# EAGLE design SD (EAGLE 7.2.0)
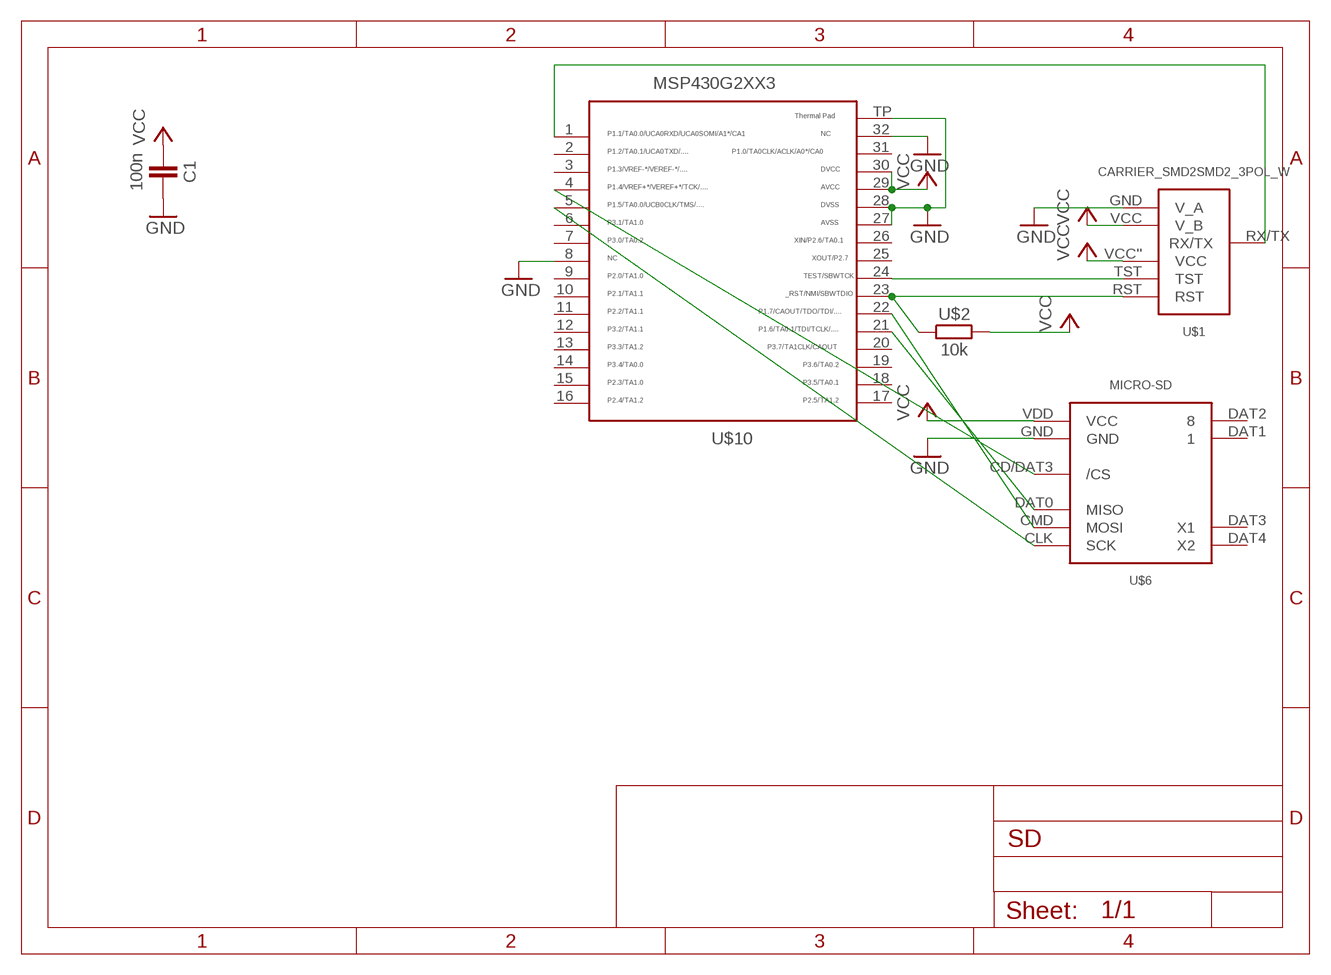
[diagram p0: schematic, sheet 1]

## Parts
C1  100n  CAPACITOR  [603]
U$1  CARRIER_SMD2SMD2_3POL_W  [CARRIER_SMD2_WIDE_3POL]
U$2  10k  RESISTOR0603  [603]
U$6  MICRO-SD  [SD-CARD-AMP]
U$10  MSP430G2553  [QFN32]

## Nets
GND: C1.2 U$1.GND(V_A) U$6.GND U$10.8 U$10.27 U$10.28 U$10.32 U$10.TP
N$3: U$1.TST U$10.24
N$4: U$1.RST U$2.1 U$10.23
N$6: U$6.CLK(SCK) U$10.5
N$7: U$6.CMD(MOSI) U$10.22
N$12: U$1.RX/TX U$10.1
N$14: U$6.DAT0(MISO) U$10.21
N$16: U$6.CD/DAT3(/CS) U$10.4
VCC: C1.1 U$1.VCC''(VCC) U$1.VCC(V_B) U$2.2 U$6.VDD(VCC) U$10.29 U$10.30
Unconnected: U$6.DAT1 U$6.DAT2 U$6.DAT3(X1) U$6.DAT4(X2) U$10.2 U$10.3 U$10.6 U$10.7 U$10.9 U$10.10 U$10.11 U$10.12 U$10.13 U$10.14 U$10.15 U$10.16 U$10.17 U$10.18 U$10.19 U$10.20 U$10.25 U$10.26 U$10.31

## Library data of the parts
C1 = thar:CAPACITOR
U$1 = thar:CARRIER_SMD2
U$2 = thar:RESISTOR
U$6 = thar:MICRO-SD: Micro SD Sockel/Footprint
U$10 = thar:MSP430G2553: TEXAS INSTRUMENTS MSP430G2553IRHB32R MCU, 16BIT, MSP430, 16MHZ, QFN-32 Farnell Best.Nr.: 2325726 Herst.Bez.: MSP430G2553IRHB32R

## Board
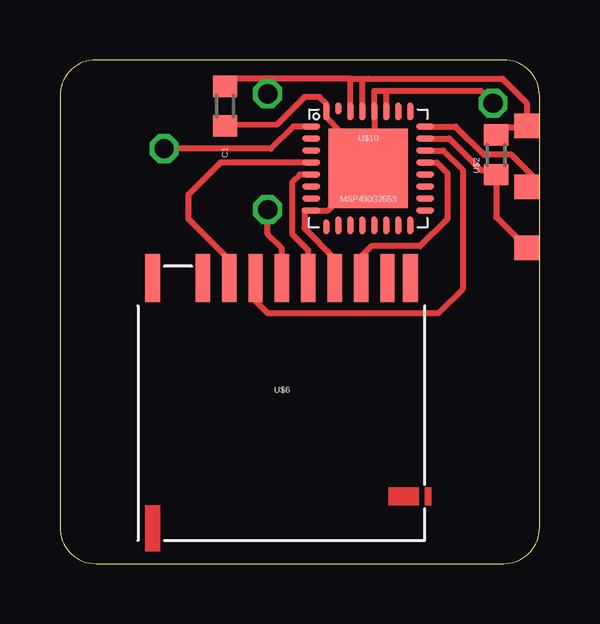
[diagram p1: board, top side]
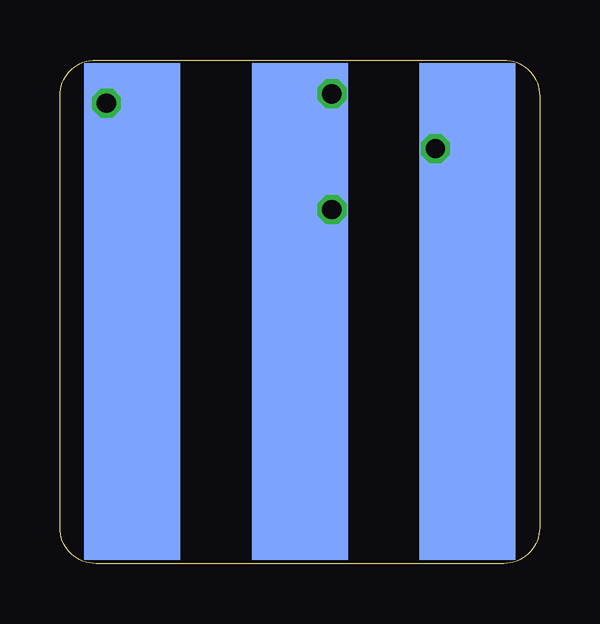
[diagram p2: board, bottom side, seen from below]

Size 20 x 21 mm. Coordinates in mm from the lower left corner, seen from the top.
Copper layers (1*16): Top 0.035mm / dielectric 1.5mm / Bottom 0.035mm
Design rules "Bilex DRU *": minimum track width 10mil, minimum drill 24mil, track to track 10mil, track to pad 10mil, pad to pad 10mil, via to via 10mil, smd to smd 10mil, copper to edge 1mil, drill to drill 8mil, minimum pad ring 10mil, minimum via ring 8mil, stop-mask expansion 4mil, vias tented up to drill 0mil, thermal gap 10mil

### Footprints (pad centres in the part's own frame; a part is rotated, then mirrored left to right if it is on the bottom)
603 = smd 0.889 x 1.016: 1 -0.826,0; 2 0.826,0
CARRIER_SMD2_WIDE_3POL = smd 4 x 20.7 bottom: GND -6.985,3.493; RX/TX 6.985,3.493; VCC 0,3.493 | smd 1.016 x 1.016: RST -9.461,0.826; TST -9.461,-1.714; VCC'' -9.461,-4.255
SD-CARD-AMP = smd 0.6 x 2: CD/DAT3 2.2,-4.4; CLK -1.1,-4.4; CMD 1.1,-4.4; DAT0 -3.3,-4.4; DAT1 -4.4,-4.4; DAT2 3.3,-4.4; GND -2.2,-4.4; VDD 0,-4.4 | smd 0.635 x 2: DAT3 -5.353,-4.4; DAT4 5.396,-4.4
QFN32 = smd 0.762 x 0.254: 1 -2.375,1.75; 2 -2.375,1.25; 3 -2.375,0.75; 4 -2.375,0.25; 5 -2.375,-0.25; 6 -2.375,-0.75; 7 -2.375,-1.25; 8 -2.375,-1.75; 17 2.375,-1.75; 18 2.375,-1.25; 19 2.375,-0.75; 20 2.375,-0.25; 21 2.375,0.25; 22 2.375,0.75; 23 2.375,1.25; 24 2.375,1.75 | smd 0.254 x 0.635: 9 -1.75,-2.438 | smd 0.254 x 0.762: 10 -1.25,-2.375; 11 -0.75,-2.375; 12 -0.25,-2.375; 13 0.25,-2.375; 14 0.75,-2.375; 15 1.25,-2.375; 16 1.75,-2.375; 25 1.75,2.375; 26 1.25,2.375; 27 0.75,2.375; 28 0.25,2.375; 29 -0.25,2.375; 30 -0.75,2.375; 32 -1.75,2.375 | smd 0.254 x 0.508: 31 -1.25,2.5 | smd 3.302 x 3.302: TP 0,0

### Placement (x,y rotation side)
C1  6.89,19.07 270 top
U$1  10,14 180 top
U$2  18.19,17.05 90 top
U$6  9.26,7.5 180 top
U$10  12.86,16.48 0 top

### Tracks (layer width: path | path; a pad name or v marks a point on that pad's centre or on a via)
GND  (via drill 0.8)
  Top 0.254: 13.38,16.16 12.88,17.19 13.12,17.17 | 13.38,16.16 13.43,16.13 U$10.TP 12.47,16.27 12.35,16.22 12.09,15.64 11.17,14.73 U$10.8 10.19,14.73 10.19,13.99 11.46,12.72 U$6.GND | 13.11,17.55 U$10.28 13.11,19.71 13.5,19.71 | 13.11,17.55 13.11,16.87 13.38,16.16 | 13.11,17.55 12.34,17.81 11.71,18 11.11,18.61 U$10.32 11.11,19.17 10.82,19.45 10.19,19.45 9.04,18.31 7.01,18.32 | 6.92,18.35 7.01,18.32 | C1.2 7.01,18.32 | v18.06,19.2 17.55,19.71 13.5,19.71 | U$10.27 13.61,19.69 13.5,19.71
  Bottom 0.254: U$1.GND 18,18.63 v18.06,19.2
N$3
  Top 0.254: U$1.TST 19.71,16.15 18.82,17.05 17.68,17.05 16.54,18.18 16.5,18.23 U$10.24
N$4
  Top 0.254: U$2.1 18.19,14.45 U$1.RST | 18.06,16.16 17.87,16.28 U$2.1 | U$10.23 16.24,17.73 17.55,16.41 18.26,16.41 U$2.1
N$6
  Top 0.254: U$10.5 10.01,16.23 9.68,15.9 9.68,13.74 10.36,13.06 U$6.CLK
N$7
  Top 0.254: U$10.22 15.97,17.23 16.79,16.41 16.79,11.45 15.78,10.44 8.66,10.44 8.16,10.94 U$6.CMD
N$12  (via drill 0.8)
  Top 0.254: U$10.1 9.72,18.23 8.79,17.3 v4.35,17.3
  Bottom 0.254: U$1.RX/TX 3.01,16.28 v4.35,17.3
N$14
  Top 0.254: U$10.21 15.71,16.73 16.16,16.28 16.16,14.38 15.01,13.23 12.98,13.23 12.6,12.85 12.6,11.94 U$6.DAT0
N$16
  Top 0.254: U$6.CD/DAT3 7.06,12.68 5.36,14.38 5.36,15.39 6.7,16.73 U$10.4
VCC  (via drill 0.8)
  Top 0.254: U$10.30 12.11,20.22 | 12.11,20.22 12.86,20.22 | 12.86,20.22 18.44,20.22 19.46,19.2 U$1.VCC'' | 12.11,20.22 8.67,20.22 | 8.67,20.22 7.01,20.22 | 6.95,20.22 C1.1 6.89,20.22 6.95,20.22 | 6.95,20.22 7.01,20.22 | 8.67,20.22 v8.66,19.59 | U$1.VCC'' 19.65,18.25 19.71,18.32 | U$2.2 18.06,17.93 18.19,18.19 19.27,18.19 U$1.VCC'' | U$10.29 12.61,20.22 12.86,20.22 | 7.01,20.22 | U$6.VDD 9.26,13.15 8.66,13.74 v8.66,14.76
  Bottom 0.254: v8.66,19.59 10,19.59 U$1.VCC 10,18.25 v8.66,19.58 v8.66,14.76